# EAGLE schematic EmbiggenedKeyboard (EAGLE 9.5.2)
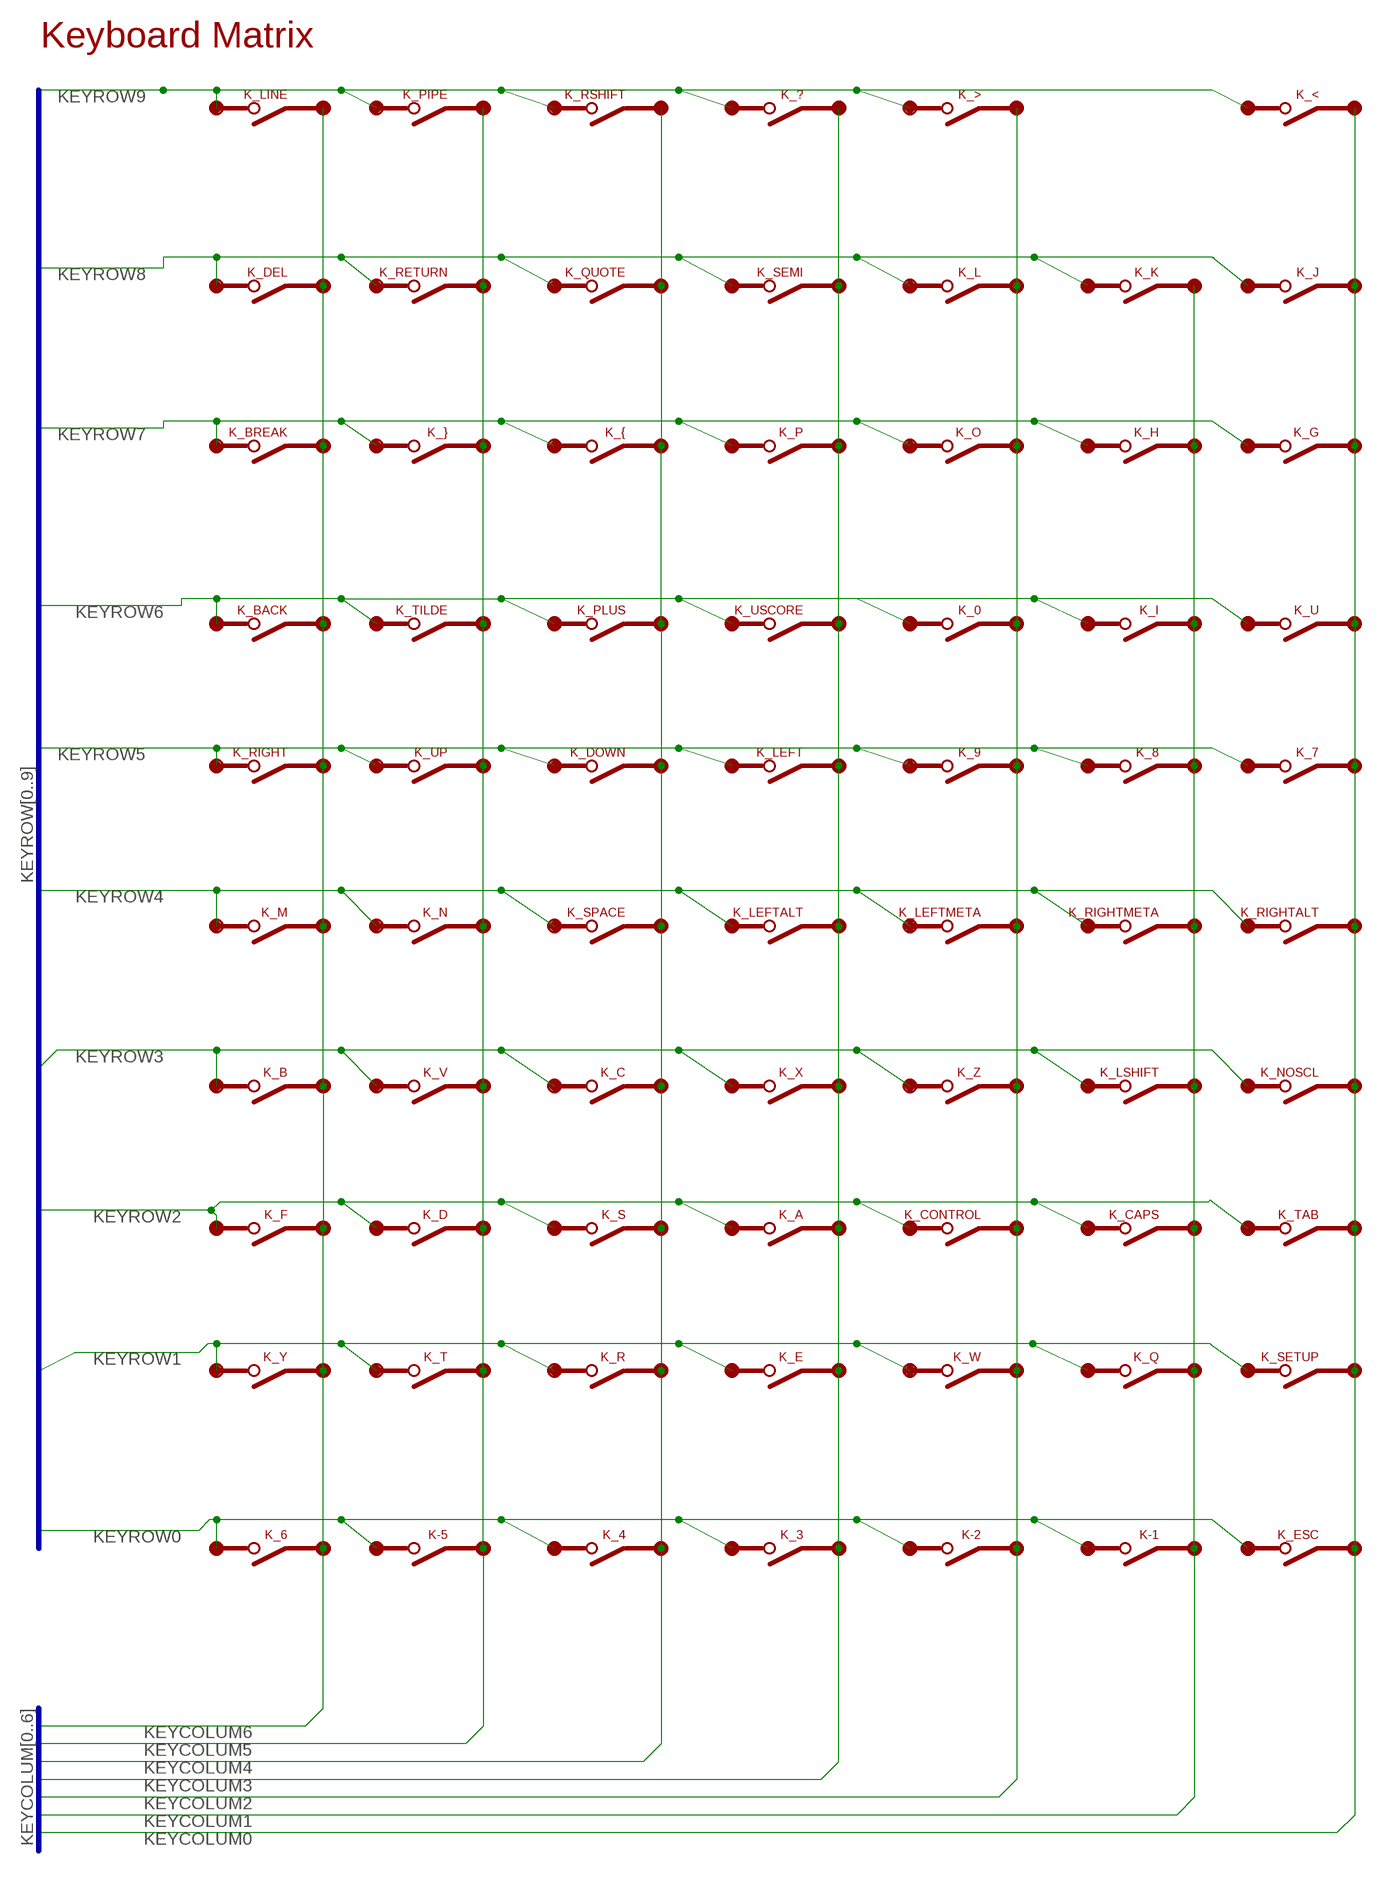
[diagram p0: schematic, sheet 1, part 1 of 2]
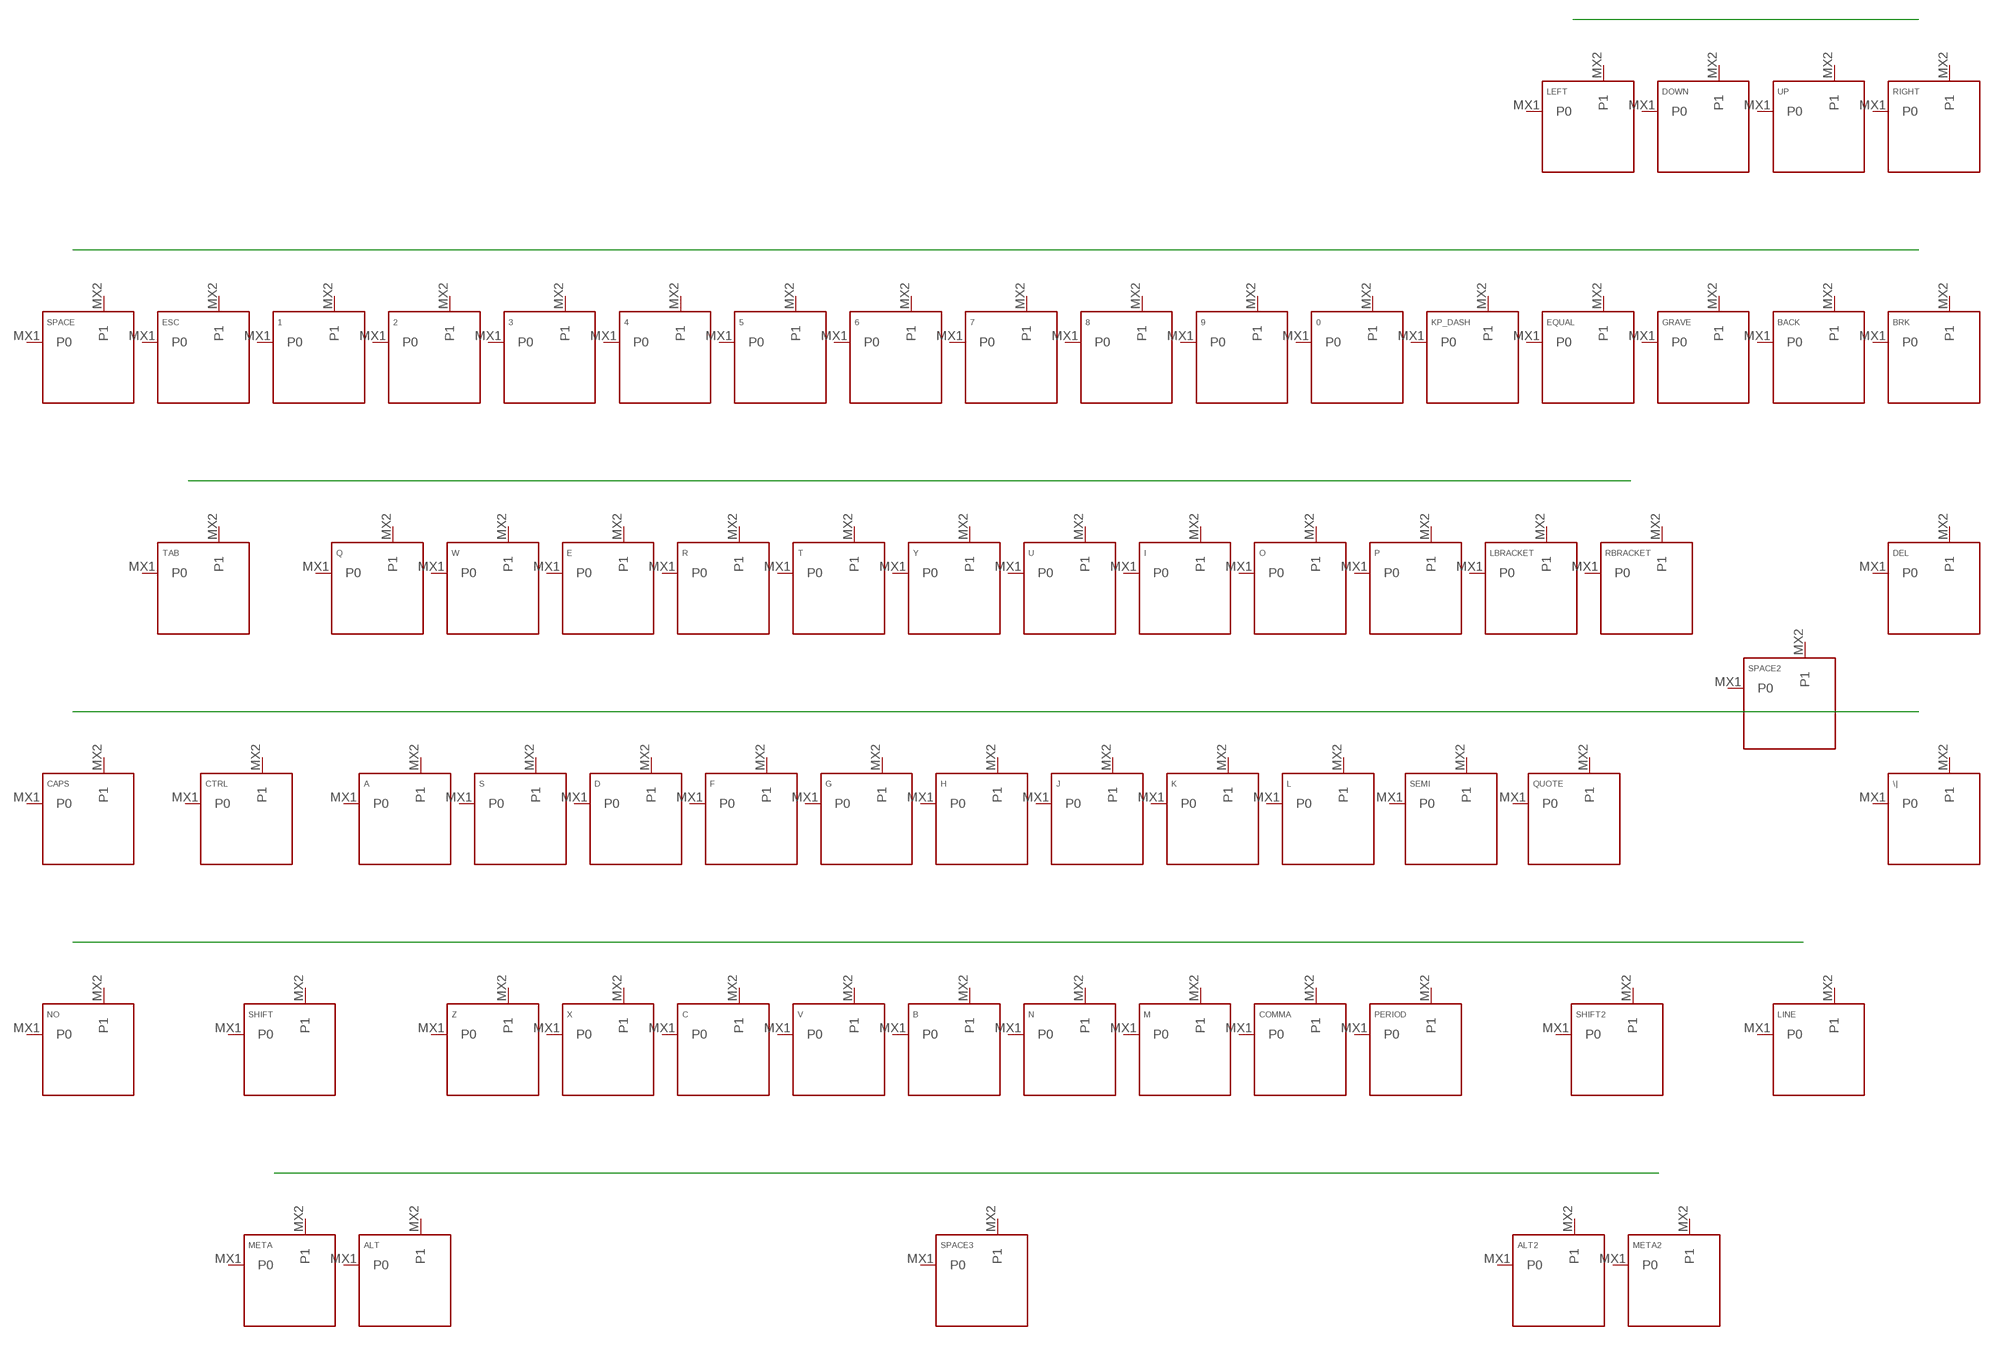
[diagram p1: schematic, sheet 1, part 2 of 2]

## Parts
0  KEYSWITCH-PLAIN-MX-1U  [MX-1U]
1  KEYSWITCH-PLAIN-MX-1U  [MX-1U]
2  KEYSWITCH-PLAIN-MX-1U  [MX-1U]
3  KEYSWITCH-PLAIN-MX-1U  [MX-1U]
4  KEYSWITCH-PLAIN-MX-1U  [MX-1U]
5  KEYSWITCH-PLAIN-MX-1U  [MX-1U]
6  KEYSWITCH-PLAIN-MX-1U  [MX-1U]
7  KEYSWITCH-PLAIN-MX-1U  [MX-1U]
8  KEYSWITCH-PLAIN-MX-1U  [MX-1U]
9  KEYSWITCH-PLAIN-MX-1U  [MX-1U]
\|  KEYSWITCH-PLAIN-MX-1U  [MX-1U]
A  KEYSWITCH-PLAIN-MX-1U  [MX-1U]
ALT  KEYSWITCH-PLAIN-MX-1U  [MX-1U]
ALT2  KEYSWITCH-PLAIN-MX-1U  [MX-1U]
B  KEYSWITCH-PLAIN-MX-1U  [MX-1U]
BACK  KEYSWITCH-PLAIN-MX-1U  [MX-1U]
BRK  KEYSWITCH-PLAIN-MX-1U  [MX-1U]
C  KEYSWITCH-PLAIN-MX-1U  [MX-1U]
CAPS  KEYSWITCH-PLAIN-MX-1U  [MX-1U]
COMMA  KEYSWITCH-PLAIN-MX-1U  [MX-1U]
CTRL  KEYSWITCH-PLAIN-MX-1U  [MX-1U]
D  KEYSWITCH-PLAIN-MX-1U  [MX-1U]
DEL  KEYSWITCH-PLAIN-MX-1U  [MX-1U]
DOWN  KEYSWITCH-PLAIN-MX-1U  [MX-1U]
E  KEYSWITCH-PLAIN-MX-1U  [MX-1U]
EQUAL  KEYSWITCH-PLAIN-MX-1U  [MX-1U]
ESC  KEYSWITCH-PLAIN-MX-1U  [MX-1U]
F  KEYSWITCH-PLAIN-MX-1U  [MX-1U]
G  KEYSWITCH-PLAIN-MX-1U  [MX-1U]
GRAVE  KEYSWITCH-PLAIN-MX-1U  [MX-1U]
H  KEYSWITCH-PLAIN-MX-1U  [MX-1U]
I  KEYSWITCH-PLAIN-MX-1U  [MX-1U]
J  KEYSWITCH-PLAIN-MX-1U  [MX-1U]
K  KEYSWITCH-PLAIN-MX-1U  [MX-1U]
K-1  1U_PAD  [SILICONE_SWITCH]
K-2  1U_PAD  [SILICONE_SWITCH]
K-5  1U_PAD  [SILICONE_SWITCH]
K_0  1U_PAD  [SILICONE_SWITCH]
K_3  1U_PAD  [SILICONE_SWITCH]
K_4  1U_PAD  [SILICONE_SWITCH]
K_6  1U_PAD  [SILICONE_SWITCH]
K_7  1U_PAD  [SILICONE_SWITCH]
K_8  1U_PAD  [SILICONE_SWITCH]
K_9  1U_PAD  [SILICONE_SWITCH]
K_<  1U_PAD  [SILICONE_SWITCH]
K_>  1U_PAD  [SILICONE_SWITCH]
K_?  1U_PAD  [SILICONE_SWITCH]
K_A  1U_PAD  [SILICONE_SWITCH]
K_B  1U_PAD  [SILICONE_SWITCH]
K_BACK  1U_PAD  [SILICONE_SWITCH]
K_BREAK  1U_PAD  [SILICONE_SWITCH]
K_C  1U_PAD  [SILICONE_SWITCH]
K_CAPS  1U_PAD  [SILICONE_SWITCH]
K_CONTROL  2U_PAD  [SILICONE_SWITCH_2U]
K_D  1U_PAD  [SILICONE_SWITCH]
K_DEL  1U_PAD  [SILICONE_SWITCH]
K_DOWN  1U_PAD  [SILICONE_SWITCH]
K_E  1U_PAD  [SILICONE_SWITCH]
K_ESC  1U_PAD  [SILICONE_SWITCH]
K_F  1U_PAD  [SILICONE_SWITCH]
K_G  1U_PAD  [SILICONE_SWITCH]
K_H  1U_PAD  [SILICONE_SWITCH]
K_I  1U_PAD  [SILICONE_SWITCH]
K_J  1U_PAD  [SILICONE_SWITCH]
K_K  1U_PAD  [SILICONE_SWITCH]
K_L  1U_PAD  [SILICONE_SWITCH]
K_LEFT  1U_PAD  [SILICONE_SWITCH]
K_LEFTALT  1U_PAD  [SILICONE_SWITCH]
K_LEFTMETA  1U_PAD  [SILICONE_SWITCH]
K_LINE  1U_PAD  [SILICONE_SWITCH]
K_LSHIFT  2U_PAD  [SILICONE_SWITCH_2U]
K_M  1U_PAD  [SILICONE_SWITCH]
K_N  1U_PAD  [SILICONE_SWITCH]
K_NOSCL  1U_PAD  [SILICONE_SWITCH]
K_O  1U_PAD  [SILICONE_SWITCH]
K_P  1U_PAD  [SILICONE_SWITCH]
K_PIPE  1U_PAD  [SILICONE_SWITCH]
K_PLUS  1U_PAD  [SILICONE_SWITCH]
K_Q  1U_PAD  [SILICONE_SWITCH]
K_QUOTE  1U_PAD  [SILICONE_SWITCH]
K_R  1U_PAD  [SILICONE_SWITCH]
K_RETURN  RETURN_PAD  [SILICONE_RETURN]
K_RIGHT  1U_PAD  [SILICONE_SWITCH]
K_RIGHTALT  1U_PAD  [SILICONE_SWITCH]
K_RIGHTMETA  1U_PAD  [SILICONE_SWITCH]
K_RSHIFT  2U_PAD  [SILICONE_SWITCH_2U]
K_S  1U_PAD  [SILICONE_SWITCH]
K_SEMI  1U_PAD  [SILICONE_SWITCH]
K_SETUP  2U_PAD  [SILICONE_SWITCH_2U]
K_SPACE  SPACE_PAD  [SILICONE_SPACE]
K_T  1U_PAD  [SILICONE_SWITCH]
K_TAB  1U_PAD  [SILICONE_SWITCH]
K_TILDE  1U_PAD  [SILICONE_SWITCH]
K_U  1U_PAD  [SILICONE_SWITCH]
K_UP  1U_PAD  [SILICONE_SWITCH]
K_USCORE  1U_PAD  [SILICONE_SWITCH]
K_V  1U_PAD  [SILICONE_SWITCH]
K_W  1U_PAD  [SILICONE_SWITCH]
K_X  1U_PAD  [SILICONE_SWITCH]
K_Y  1U_PAD  [SILICONE_SWITCH]
K_Z  1U_PAD  [SILICONE_SWITCH]
K_{  1U_PAD  [SILICONE_SWITCH]
K_}  1U_PAD  [SILICONE_SWITCH]
KP_DASH  KEYSWITCH-PLAIN-MX-1U  [MX-1U]
L  KEYSWITCH-PLAIN-MX-1U  [MX-1U]
LBRACKET  KEYSWITCH-PLAIN-MX-1U  [MX-1U]
LEFT  KEYSWITCH-PLAIN-MX-1U  [MX-1U]
LINE  KEYSWITCH-PLAIN-MX-1U  [MX-1U]
M  KEYSWITCH-PLAIN-MX-1U  [MX-1U]
META  KEYSWITCH-PLAIN-MX-1U  [MX-1U]
META2  KEYSWITCH-PLAIN-MX-1U  [MX-1U]
N  KEYSWITCH-PLAIN-MX-1U  [MX-1U]
NO  KEYSWITCH-PLAIN-MX-1U  [MX-1U]
O  KEYSWITCH-PLAIN-MX-1U  [MX-1U]
P  KEYSWITCH-PLAIN-MX-1U  [MX-1U]
PERIOD  KEYSWITCH-PLAIN-MX-1U  [MX-1U]
Q  KEYSWITCH-PLAIN-MX-1U  [MX-1U]
QUOTE  KEYSWITCH-PLAIN-MX-1U  [MX-1U]
R  KEYSWITCH-PLAIN-MX-1U  [MX-1U]
RBRACKET  KEYSWITCH-PLAIN-MX-1U  [MX-1U]
RIGHT  KEYSWITCH-PLAIN-MX-1U  [MX-1U]
S  KEYSWITCH-PLAIN-MX-1U  [MX-1U]
SEMI  KEYSWITCH-PLAIN-MX-1U  [MX-1U]
SHIFT  KEYSWITCH-PLAIN-MX-1U  [MX-1U]
SHIFT2  KEYSWITCH-PLAIN-MX-1U  [MX-1U]
SPACE  KEYSWITCH-PLAIN-MX-1U  [MX-1U]
SPACE2  KEYSWITCH-PLAIN-MX-1U  [MX-1U]
SPACE3  KEYSWITCH-PLAIN-MX-1U  [MX-1U]
T  KEYSWITCH-PLAIN-MX-1U  [MX-1U]
TAB  KEYSWITCH-PLAIN-MX-1U  [MX-1U]
U  KEYSWITCH-PLAIN-MX-1U  [MX-1U]
UP  KEYSWITCH-PLAIN-MX-1U  [MX-1U]
V  KEYSWITCH-PLAIN-MX-1U  [MX-1U]
W  KEYSWITCH-PLAIN-MX-1U  [MX-1U]
X  KEYSWITCH-PLAIN-MX-1U  [MX-1U]
Y  KEYSWITCH-PLAIN-MX-1U  [MX-1U]
Z  KEYSWITCH-PLAIN-MX-1U  [MX-1U]

## Nets
KEYCOLUM0: K_7.P$2 K_<.P$2 K_ESC.P$2 K_G.P$2 K_J.P$2 K_NOSCL.P$2 K_RIGHTALT.P$2 K_SETUP.P$2 K_TAB.P$2 K_U.P$2
KEYCOLUM1: K-1.P$2 K_8.P$2 K_CAPS.P$2 K_H.P$2 K_I.P$2 K_K.P$2 K_LSHIFT.P$2 K_Q.P$2 K_RIGHTMETA.P$2
KEYCOLUM2: K-2.P$2 K_0.P$2 K_9.P$2 K_>.P$2 K_CONTROL.P$2 K_L.P$2 K_LEFTMETA.P$2 K_O.P$2 K_W.P$2 K_Z.P$2
KEYCOLUM3: K_3.P$2 K_?.P$2 K_A.P$2 K_E.P$2 K_LEFT.P$2 K_LEFTALT.P$2 K_P.P$2 K_SEMI.P$2 K_USCORE.P$2 K_X.P$2
KEYCOLUM4: K_4.P$2 K_C.P$2 K_DOWN.P$2 K_PLUS.P$2 K_QUOTE.P$2 K_R.P$2 K_RSHIFT.P$2 K_S.P$2 K_SPACE.P$2 K_{.P$2
KEYCOLUM5: K-5.P$2 K_D.P$2 K_N.P$2 K_PIPE.P$2 K_RETURN.P$2 K_T.P$2 K_TILDE.P$2 K_UP.P$2 K_V.P$2 K_}.P$2
KEYCOLUM6: K_6.P$2 K_B.P$2 K_BACK.P$2 K_BREAK.P$2 K_DEL.P$2 K_F.P$2 K_LINE.P$2 K_M.P$2 K_RIGHT.P$2 K_Y.P$2
KEYROW0: K-1.P$1 K-2.P$1 K-5.P$1 K_3.P$1 K_4.P$1 K_6.P$1 K_ESC.P$1
KEYROW1: K_E.P$1 K_Q.P$1 K_R.P$1 K_SETUP.P$1 K_T.P$1 K_W.P$1 K_Y.P$1
KEYROW2: K_A.P$1 K_CAPS.P$1 K_CONTROL.P$1 K_D.P$1 K_F.P$1 K_S.P$1 K_TAB.P$1
KEYROW3: K_B.P$1 K_C.P$1 K_LSHIFT.P$1 K_NOSCL.P$1 K_V.P$1 K_X.P$1 K_Z.P$1
KEYROW4: K_LEFTALT.P$1 K_LEFTMETA.P$1 K_M.P$1 K_N.P$1 K_RIGHTALT.P$1 K_RIGHTMETA.P$1 K_SPACE.P$1
KEYROW5: K_7.P$1 K_8.P$1 K_9.P$1 K_DOWN.P$1 K_LEFT.P$1 K_RIGHT.P$1 K_UP.P$1
KEYROW6: K_0.P$1 K_BACK.P$1 K_I.P$1 K_PLUS.P$1 K_TILDE.P$1 K_U.P$1 K_USCORE.P$1
KEYROW7: K_BREAK.P$1 K_G.P$1 K_H.P$1 K_O.P$1 K_P.P$1 K_{.P$1 K_}.P$1
KEYROW8: K_DEL.P$1 K_J.P$1 K_K.P$1 K_L.P$1 K_QUOTE.P$1 K_RETURN.P$1 K_SEMI.P$1
KEYROW9: K_<.P$1 K_>.P$1 K_?.P$1 K_LINE.P$1 K_PIPE.P$1 K_RSHIFT.P$1
Unconnected: 0.MX1(P0) 0.MX2(P1) 1.MX1(P0) 1.MX2(P1) 2.MX1(P0) 2.MX2(P1) 3.MX1(P0) 3.MX2(P1) 4.MX1(P0) 4.MX2(P1) 5.MX1(P0) 5.MX2(P1) 6.MX1(P0) 6.MX2(P1) 7.MX1(P0) 7.MX2(P1) 8.MX1(P0) 8.MX2(P1) 9.MX1(P0) 9.MX2(P1) \|.MX1(P0) \|.MX2(P1) A.MX1(P0) A.MX2(P1) ALT2.MX1(P0) ALT2.MX2(P1) ALT.MX1(P0) ALT.MX2(P1) B.MX1(P0) B.MX2(P1) BACK.MX1(P0) BACK.MX2(P1) BRK.MX1(P0) BRK.MX2(P1) C.MX1(P0) C.MX2(P1) CAPS.MX1(P0) CAPS.MX2(P1) COMMA.MX1(P0) COMMA.MX2(P1) CTRL.MX1(P0) CTRL.MX2(P1) D.MX1(P0) D.MX2(P1) DEL.MX1(P0) DEL.MX2(P1) DOWN.MX1(P0) DOWN.MX2(P1) E.MX1(P0) E.MX2(P1) EQUAL.MX1(P0) EQUAL.MX2(P1) ESC.MX1(P0) ESC.MX2(P1) F.MX1(P0) F.MX2(P1) G.MX1(P0) G.MX2(P1) GRAVE.MX1(P0) GRAVE.MX2(P1) H.MX1(P0) H.MX2(P1) I.MX1(P0) I.MX2(P1) J.MX1(P0) J.MX2(P1) K.MX1(P0) K.MX2(P1) KP_DASH.MX1(P0) KP_DASH.MX2(P1) L.MX1(P0) L.MX2(P1) LBRACKET.MX1(P0) LBRACKET.MX2(P1) LEFT.MX1(P0) LEFT.MX2(P1) LINE.MX1(P0) LINE.MX2(P1) M.MX1(P0) M.MX2(P1) META2.MX1(P0) META2.MX2(P1) META.MX1(P0) META.MX2(P1) N.MX1(P0) N.MX2(P1) NO.MX1(P0) NO.MX2(P1) O.MX1(P0) O.MX2(P1) P.MX1(P0) P.MX2(P1) PERIOD.MX1(P0) PERIOD.MX2(P1) Q.MX1(P0) Q.MX2(P1) QUOTE.MX1(P0) QUOTE.MX2(P1) R.MX1(P0) R.MX2(P1) RBRACKET.MX1(P0) RBRACKET.MX2(P1) RIGHT.MX1(P0) RIGHT.MX2(P1) S.MX1(P0) S.MX2(P1) SEMI.MX1(P0) SEMI.MX2(P1) SHIFT2.MX1(P0) SHIFT2.MX2(P1) SHIFT.MX1(P0) SHIFT.MX2(P1) SPACE2.MX1(P0) SPACE2.MX2(P1) SPACE3.MX1(P0) SPACE3.MX2(P1) SPACE.MX1(P0) SPACE.MX2(P1) T.MX1(P0) T.MX2(P1) TAB.MX1(P0) TAB.MX2(P1) U.MX1(P0) U.MX2(P1) UP.MX1(P0) UP.MX2(P1) V.MX1(P0) V.MX2(P1) W.MX1(P0) W.MX2(P1) X.MX1(P0) X.MX2(P1) Y.MX1(P0) Y.MX2(P1) Z.MX1(P0) Z.MX2(P1)

## Buses
KEYCOLUM[0..6]
KEYROW[0..9]

## Notes on the sheet
- Keyboard Matrix

## Library data of the parts
0 1-9 \| A ALT ALT2 B BACK BRK C CAPS COMMA CTRL D DEL DOWN E EQUAL ESC F G GRAVE H I J K KP_DASH L LBRACKET LEFT LINE M META META2 N NO O P PERIOD Q QUOTE R RBRACKET RIGHT S SEMI SHIFT SHIFT2 SPACE SPACE2 SPACE3 T TAB U UP V W X Y Z = Keyboard:KEYSWITCH-PLAIN
K-1 K-2 K-5 K_0 K_3 K_4 K_6-K_9 K_< K_> K_? K_A K_B K_BACK K_BREAK K_C K_CAPS K_D K_DEL K_DOWN K_E K_ESC K_F K_G K_H K_I K_J K_K K_L K_LEFT K_LEFTALT K_LEFTMETA K_LINE K_M K_N K_NOSCL K_O K_P K_PIPE K_PLUS K_Q K_QUOTE K_R K_RIGHT K_RIGHTALT K_RIGHTMETA K_S K_SEMI K_T K_TAB K_TILDE K_U K_UP K_USCORE K_V K_W K_X K_Y K_Z K_{ K_} = SiliconeSwitches:1U_PAD
K_CONTROL K_LSHIFT K_RSHIFT K_SETUP = SiliconeSwitches:2U_PAD
K_RETURN = SiliconeSwitches:RETURN_PAD
K_SPACE = SiliconeSwitches:SPACE_PAD